# EAGLE design Pi1541_HAT (EAGLE 9.2.2)
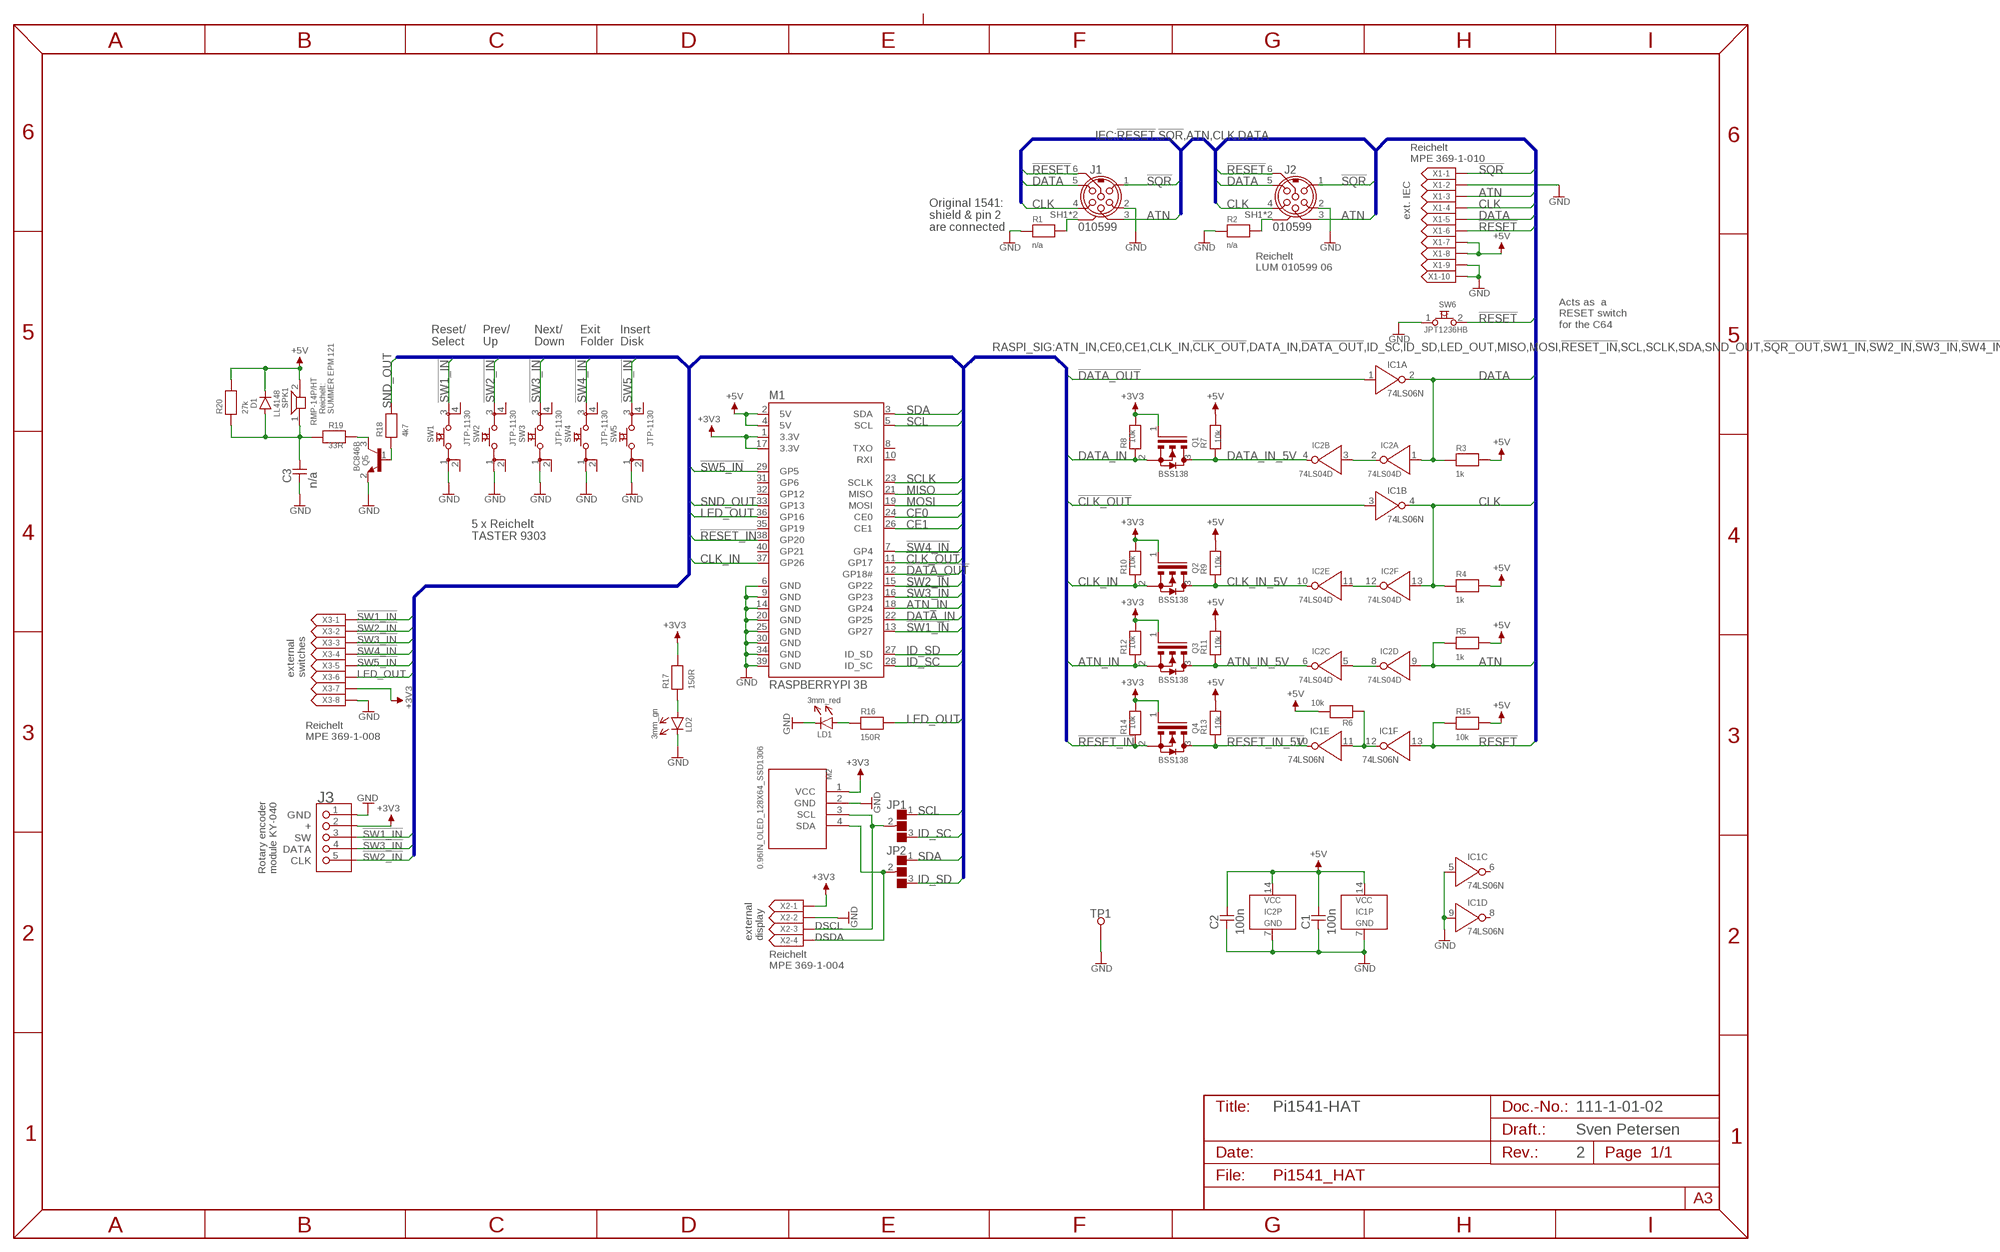
[diagram p0: schematic, sheet 1]

## Parts
C1  100n  C-0805  [0805]
C2  100n  C-0805  [0805]
C3  n/a  C-0805  [0805]
D1  LL4148  [SOD80C]
IC1  74LS06N  7406N  [DIL-14]
IC2  74LS04D  74HC04  [SO-14]
J1  010599  [010599]
J2  010599  [010599]
J3  PINHD-1X5  [1X05]
JP1  JMP_0603  [CP3P]
JP2  JMP_0603  [CP3P]
LD1  3mm_red  3MM  [3MM]
LD2  3mm_gn  3MM  [3MM]
M1  RASPBERRYPI 3B  RASPBERRYPI-40-PIN-GPIO  [PI_HAT_40P]
M2  0.96IN_OLED_128X64_SSD1306  [OLED_0.96_SSD1306]
Q1  BSS138  [SOT23]
Q2  BSS138  [SOT23]
Q3  BSS138  [SOT23]
Q4  BSS138  [SOT23]
Q5  BC846B  BC846  [SOT23]
R1  n/a  R-0805  [0805]
R2  n/a  R-0805  [0805]
R3  1k  R-0805  [0805]
R4  1k  R-0805  [0805]
R5  1k  R-0805  [0805]
R6  10k  R-0805  [0805]
R7  10k  R-0805  [0805]
R8  10k  R-0805  [0805]
R9  10k  R-0805  [0805]
R10  10k  R-0805  [0805]
R11  10k  R-0805  [0805]
R12  10k  R-0805  [0805]
R13  10k  R-0805  [0805]
R14  10k  R-0805  [0805]
R15  10k  R-0805  [0805]
R16  150R  R-0805  [0805]
R17  150R  R-0805  [0805]
R18  4k7  R-0805  [0805]
R19  33R  R-0805  [0805]
R20  27k  R-0805  [0805]
SPK1  RMP-14P/HT  [RMP-14P/HT]
SW1  JTP-1130  [JTP-1130]
SW2  JTP-1130  [JTP-1130]
SW3  JTP-1130  [JTP-1130]
SW4  JTP-1130  [JTP-1130]
SW5  JTP-1130  [JTP-1130]
SW6  JPT1236HB  [JTP_1236HB]
TP1  L1,2_R  [1,2MM_R]
X1  369-1-010  MICMA10B-THT  [MICMA10B]
X2  369-1-004  MICMA04B-THR  [MICMA04B]
X3  369-1-008  MICMA08B  [MICMA08B]

## Nets
!CLK_OUT: IC1.3(B:I) M1.11(GP17)
!DATA_OUT: IC1.1(A:I) M1.12(GP18#)
!RESET: IC1.13(F:I) J1.6 J2.6 R15.1 SW6.2 X1.6
!RESET_IN: M1.38(GP20) Q4.2(S) R14.1
!RESET_IN_5V: IC1.10(E:O) Q4.3(D) R13.1
!SQR: J1.1 J2.1 X1.1
!SW1_IN: J3.3 M1.13(GP27) SW1.3 X3.1
!SW2_IN: J3.5 M1.15(GP22) SW2.3 X3.2
!SW3_IN: J3.4 M1.16(GP23) SW3.3 X3.3
!SW4_IN: M1.7(GP4) SW4.3 X3.4
!SW5_IN: M1.29(GP5) SW5.3 X3.5
+3V3: J3.2 M1.1(3.3V) M1.17(3.3V) M2.1(VCC) Q1.1(G) Q2.1(G) Q3.1(G) Q4.1(G) R8.2 R10.2 R12.2 R14.2 R17.2 X2.1 X3.7
+5V: C1.2 C2.2 D1.K IC1.14(P:VCC) IC2.14(P:VCC) M1.2(5V) M1.4(5V) R3.2 R4.2 R5.2 R6.2 R7.2 R9.2 R11.2 R13.2 R15.2 R20.2 SPK1.2 X1.7 X1.8
ATN: IC2.9(D:I) J1.3 J2.3 R5.1 X1.3
ATN_IN: M1.18(GP24) Q3.2(S) R12.1
ATN_IN_5V: IC2.6(C:O) Q3.3(D) R11.1
CE0: M1.24(CE0)
CE1: M1.26(CE1)
CLK: IC1.4(B:O) IC2.13(F:I) J1.4 J2.4 R4.1 X1.4
CLK_IN: M1.37(GP26) Q2.2(S) R10.1
CLK_IN_5V: IC2.10(E:O) Q2.3(D) R9.1
DATA: IC1.2(A:O) IC2.1(A:I) J1.5 J2.5 R3.1 X1.5
DATA_IN: M1.22(GP25) Q1.2(S) R8.1
DATA_IN_5V: IC2.4(B:O) Q1.3(D) R7.1
DSCL: JP1.2 M2.3(SCL) X2.3
DSDA: JP2.2 M2.4(SDA) X2.4
GND: C1.1 C2.1 C3.1 IC1.5(C:I) IC1.7(P:GND) IC1.9(D:I) IC2.7(P:GND) J1.2 J2.2 J3.1 LD1.K LD2.K M1.6(GND) M1.9(GND) M1.14(GND) M1.20(GND) M1.25(GND) M1.30(GND) M1.34(GND) M1.39(GND) M2.2(GND) Q5.2(E) R1.1 R2.1 SW1.1 SW2.1 SW3.1 SW4.1 SW5.1 SW6.1 TP1.1 X1.2 X1.9 X1.10 X2.2 X3.8
ID_SC: JP1.3 M1.28(ID_SC)
ID_SD: JP2.3 M1.27(ID_SD)
LED_OUT: M1.36(GP16) R16.2 X3.6
MISO: M1.21(MISO)
MOSI: M1.19(MOSI)
N$1: J1.SH1(SH) J1.SH2(SH) R1.2
N$2: J2.SH1(SH) J2.SH2(SH) R2.2
N$3: IC2.2(A:O) IC2.3(B:I)
N$4: IC2.11(E:I) IC2.12(F:O)
N$5: IC2.5(C:I) IC2.8(D:O)
N$6: IC1.11(E:I) IC1.12(F:O) R6.1
N$7: LD2.A R17.1
N$8: Q5.1(B) R18.1
N$9: Q5.3(C) R19.2
N$10: C3.2 D1.A R19.1 R20.1 SPK1.1
N$12: LD1.A R16.1
SCL: JP1.1 M1.5(SCL)
SCLK: M1.23(SCLK)
SDA: JP2.1 M1.3(SDA)
SND_OUT: M1.33(GP13) R18.2
Unconnected: IC1.6(C:O) IC1.8(D:O) M1.8(TXO) M1.10(RXI) M1.31(GP6) M1.32(GP12) M1.35(GP19) M1.40(GP21) SW1.2 SW1.4 SW2.2 SW2.4 SW3.2 SW3.4 SW4.2 SW4.4 SW5.2 SW5.4

## Buses
IEC:!RESET,!SQR,ATN,CLK,DATA
RASPI_SIG:ATN_IN,CE0,CE1,CLK_IN,!CLK_OUT,DATA_IN,!DATA_OUT,ID_SC,ID_SD,LED_OUT,MISO,MOSI,!RESET_IN,SCL,SCLK,SDA,SND_OUT,!SQR_OUT,!SW1_IN,!SW2_IN,!SW3_IN,!SW4_IN,!SW5_IN

## Notes on the sheet
- Reichelt
  MPE 369-1-010
- ext. IEC
- Original 1541:
  shield & pin 2 
  are connected
- Reichelt
  LUM 010599 06
- Acts as  a
  RESET switch
  for the C64
- Reset/
  Select
- Prev/
  Up
- Next/
  Down
- Exit
  Folder
- Insert
  Disk
- Reichelt:
  SUMMER EPM 121
- 5 x Reichelt
  TASTER 9303
- external
  switches
- Reichelt
  MPE 369-1-008
- GND
- +
- Rotary encoder
  module KY-040
- SW
- DATA
- CLK
- external
  display
- Reichelt
  MPE 369-1-004
- Pi1541-HAT | 111-1-01-02
- Sven Petersen
- 2

## Library data of the parts
C1-C3 = SMD:C-0805
D1 = Dioden:LL4148
IC1 = 74XXsmd:7406
IC2 = 74XXsmd:74*04: Hex inverter
J1 J2 = Lumberg:010599
J3 = PINHEAD:PINHD-1X5
JP1 JP2 = Cutpad:JMP_0603
LD1 LD2 = LED:3MM
M1 = Raspberry_Pi:RASPBERRYPI-40-PIN-GPIO: 40 pin GPIO header with the footprint of a HAT
M2 = OLED_Display:0.96IN_OLED_128X64_SSD1306
Q1-Q4 = Transistoren:BSS138
Q5 = Transistoren:BC846
R1-R20 = SMD:R-0805
SPK1 = KM:RMP-14P/HT
SW1-SW5 = Namae_Electronics:JTP-1130
SW6 = Namae_Electronics:JPT1236HB
TP1 = Pads:L1,2_R
X1 = AMP:MICMA10B
X2 = AMP:MICMA04B
X3 = AMP:MICMA08B

## Board
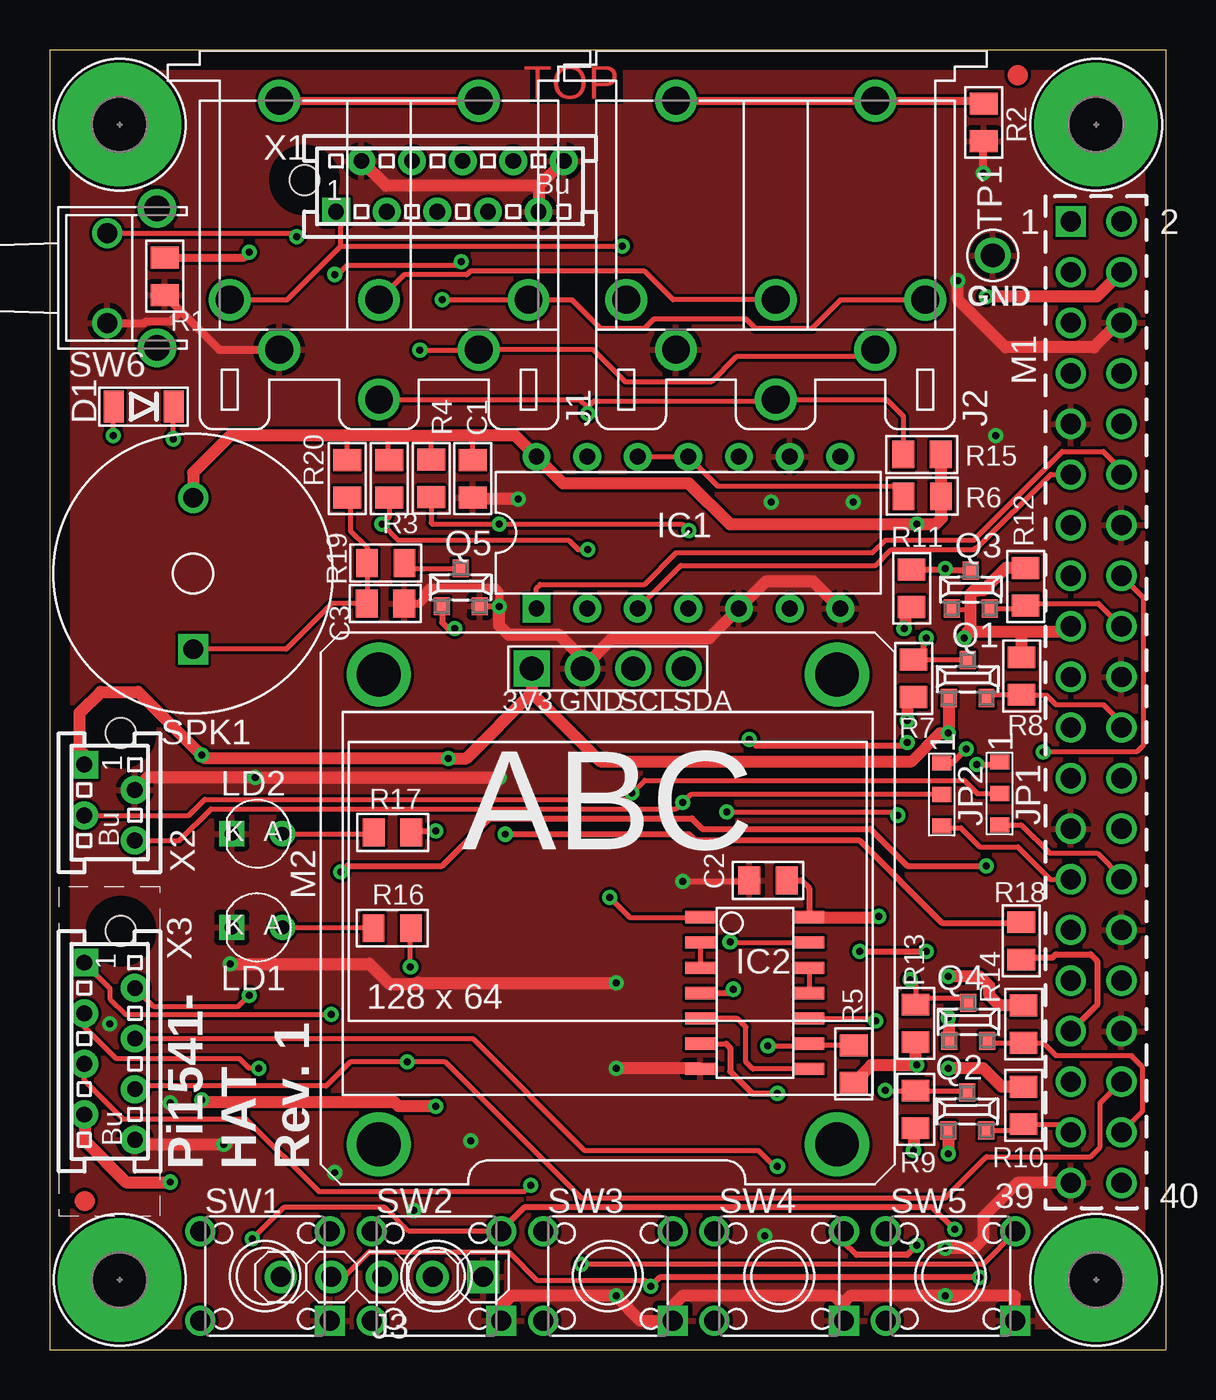
[diagram p1: board, top side]
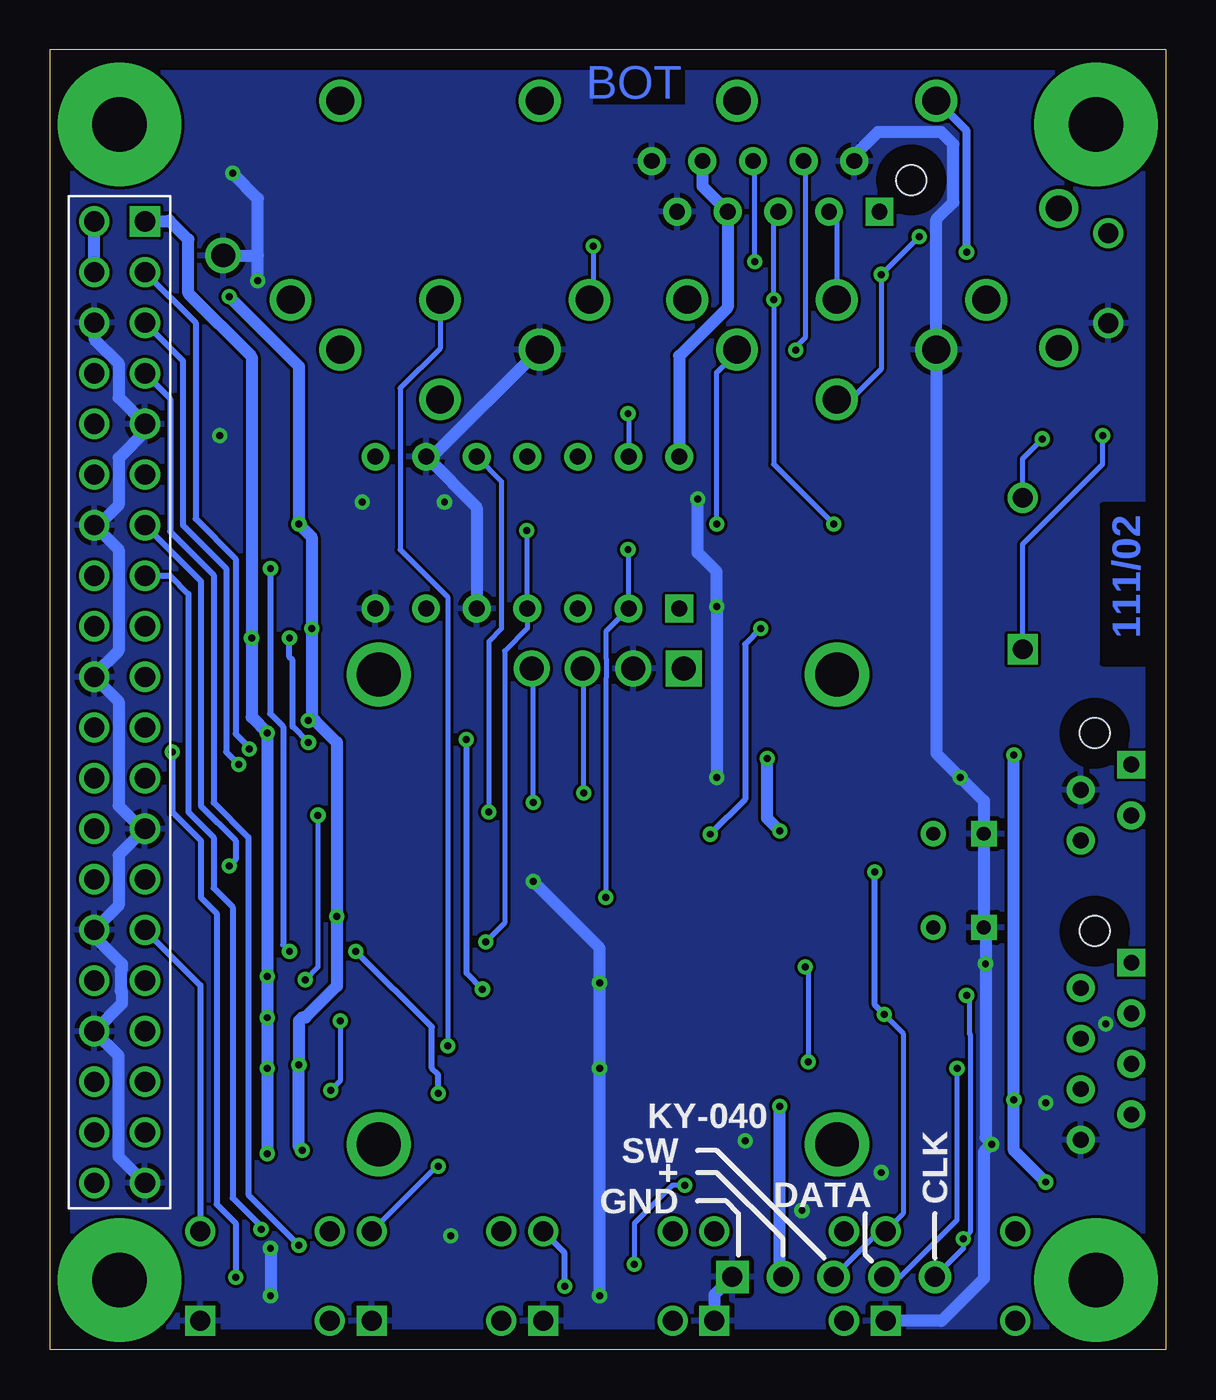
[diagram p2: board, bottom side, seen from below]

Size 56 x 65.25 mm. Coordinates in mm from the lower left corner, seen from the top.
Outline: 0,0 56,0 56,65.25 0,65.25 0,0
Copper layers (1*16): Top 0.035mm / dielectric 1.5mm / Bottom 0.035mm
Design rules "default *": minimum track width 6mil, minimum drill 0.35mm, track to track 6mil, track to pad 6mil, pad to pad 6mil, via to via 6mil, smd to smd 6mil, copper to edge 40mil, drill to drill 6mil, minimum pad ring 10mil, minimum via ring 8mil, stop-mask expansion 4mil, vias tented up to drill 0.5mm, thermal gap 10mil
bRestrict: 3 lines

### Footprints (pad centres in the part's own frame; a part is rotated, then mirrored left to right if it is on the bottom)
0805 = smd 1.092 x 1.397: 1 -0.94,0; 2 0.94,0
SOD80C = smd 1 x 1.6: A -1.5,0; K 1.5,0
DIL-14 = drill 0.8 pad 1.397 square: 1 -7.62,-3.81 | drill 0.8 pad 1.397: 2 -5.08,-3.81; 3 -2.54,-3.81; 4 0,-3.81; 5 2.54,-3.81; 6 5.08,-3.81; 7 7.62,-3.81; 8 7.62,3.81; 9 5.08,3.81; 10 2.54,3.81; 11 0,3.81; 12 -2.54,3.81; 13 -5.08,3.81; 14 -7.62,3.81
SO-14 = smd 0.61 x 1.524: 1 -3.81,-2.794; 2 -2.54,-2.794; 3 -1.27,-2.794; 4 0,-2.794; 5 1.27,-2.794; 6 2.54,-2.794; 7 3.81,-2.794; 8 3.81,2.667; 9 2.54,2.667; 10 1.27,2.667; 11 0,2.667; 12 -1.27,2.667; 13 -2.54,2.667; 14 -3.81,2.667
010599 = drill 1.4: 1 10,-7.5; 2 12.5,-5; 3 10,0; 4 12.5,5; 5 10,7.5; 6 15,0; SH1 0,5; SH2 0,-5
1X05 = drill 1 pad 1.626 square: 1 -5.08,0 | drill 1 pad 1.626: 2 -2.54,0; 3 0,0; 4 2.54,0; 5 5.08,0
CP3P = smd 0.762 x 0.965: 1 -1.575,0; 2 0,0; 3 1.575,0
3MM = drill 0.7 pad 1.27: A -1.27,0 | drill 0.7 pad 1.27 square: K 1.27,0
PI_HAT_40P = drill 1.016 square: 1 -1.27,24.13 | drill 1.016: 2 1.27,24.13; 3 -1.27,21.59; 4 1.27,21.59; 5 -1.27,19.05; 6 1.27,19.05; 7 -1.27,16.51; 8 1.27,16.51; 9 -1.27,13.97; 10 1.27,13.97; 11 -1.27,11.43; 12 1.27,11.43; 13 -1.27,8.89; 14 1.27,8.89; 15 -1.27,6.35; 16 1.27,6.35; 17 -1.27,3.81; 18 1.27,3.81; 19 -1.27,1.27; 20 1.27,1.27; 21 -1.27,-1.27; 22 1.27,-1.27; 23 -1.27,-3.81; 24 1.27,-3.81; 25 -1.27,-6.35; 26 1.27,-6.35; 27 -1.27,-8.89; 28 1.27,-8.89; 29 -1.27,-11.43; 30 1.27,-11.43; 31 -1.27,-13.97; 32 1.27,-13.97; 33 -1.27,-16.51; 34 1.27,-16.51; 35 -1.27,-19.05; 36 1.27,-19.05; 37 -1.27,-21.59; 38 1.27,-21.59; 39 -1.27,-24.13; 40 1.27,-24.13 | drill 2.75 pad 6.2: BHR1 0,-29; BHR2 0,29; BHR3 -49,29; BHR4 -49,-29
OLED_0.96_SSD1306 = drill 1.2 square: 1 -3.81,-1.8 | drill 1.2: 2 -1.27,-1.8; 3 1.27,-1.8; 4 3.81,-1.8 | drill 2.2 pad 3: MH1 -11.5,-2.1; MH2 11.5,-2.1; MH3 11.5,-25.7; MH4 -11.5,-25.7
SOT23 = smd 0.8 x 0.9: 1 -0.953,-0.953; 2 0.953,-0.953; 3 0,0.953
RMP-14P/HT = drill 1 square: 1 0,3.8 | drill 1: 2 0,-3.8
JTP-1130 = drill 1 square: 1 3.25,-2.25 | drill 1: 2 -3.25,-2.25; 3 3.25,2.25; 4 -3.25,2.25
JTP_1236HB = drill 1: 1 2.25,0; 2 -2.25,0 | drill 1.3: CS1 3.5,2.5; CS2 -3.5,2.5
1,2MM_R = drill 1.2: 1 0,0
MICMA10B = drill 0.787 pad 1.397 square: 1 5.715,1.27 | drill 0.787 pad 1.397: 2 4.445,-1.27; 3 3.175,1.27; 4 1.905,-1.27; 5 0.635,1.27; 6 -0.635,-1.27; 7 -1.905,1.27; 8 -3.175,-1.27; 9 -4.445,1.27; 10 -5.715,-1.27 | hole 1.499: 7.303,-0.318
MICMA04B = drill 0.8 pad 1.397 square: 1 1.905,1.27 | drill 0.8 pad 1.397: 2 0.635,-1.27; 3 -0.635,1.27; 4 -1.905,-1.27 | hole 1.5: 3.493,-0.568
MICMA08B = drill 0.787 pad 1.397 square: 1 4.445,1.27 | drill 0.787 pad 1.397: 2 3.175,-1.27; 3 1.905,1.27; 4 0.635,-1.27; 5 -0.635,1.27; 6 -1.905,-1.27; 7 -3.175,1.27; 8 -4.445,-1.27 | hole 1.5: 6.032,-0.568

### Placement (x,y rotation side)
C1  21.22,43.72 90 top
C2  36.04,23.56 0 top
C3  16.84,37.46 180 top
D1  4.71,47.34 0 top
IC1  32.04,41.01 0 top
IC2  35.44,17.9 270 top
J1  16.52,62.7 270 top
J2  36.42,62.7 270 top
J3  16.67,3.65 180 top
JP1  47.66,27.92 270 top
JP2  44.76,27.87 270 top
LD1  10.4,21.2 180 top
LD2  10.4,25.9 180 top
M1  52.5,32.5 0 top
M2  28,36 0 top
Q1  46.05,33.66 0 top
Q2  46.03,11.96 0 top
Q3  46.21,38.16 0 top
Q4  46.09,16.46 0 top
Q5  20.61,38.27 0 top
R1  5.76,53.88 90 top
R2  46.86,61.6 90 top
R3  17.04,43.72 90 top
R4  19.14,43.74 90 top
R5  40.34,14.34 270 top
R6  43.78,42.84 0 top
R7  43.34,33.7 270 top
R8  48.76,33.82 90 top
R9  43.44,12.06 270 top
R10  48.86,12.26 90 top
R11  43.24,38.22 270 top
R12  48.96,38.3 90 top
R13  43.44,16.38 270 top
R14  48.86,16.34 90 top
R15  43.76,44.94 0 top
R16  17.18,21.16 0 top
R17  17.2,25.96 0 top
R18  48.74,20.52 270 top
R19  16.86,39.48 0 top
R20  14.92,43.72 90 top
SPK1  7.19,38.96 180 top
SW1  10.8,3.7 0 top
SW2  19.4,3.7 0 top
SW3  28,3.7 0 top
SW4  36.6,3.7 0 top
SW5  45.2,3.7 0 top
SW6  2.88,53.79 270 top
TP1  47.31,54.93 0 top
U$44  [2LAYER]  28.57,64.45 180 top
U$45  [PCB-TITLE/]  0,75.08 0 top  (outside the outline)
U$47  [SMD_REF_R1MM]  1.75,7.46 0 top
U$48  [SMD_REF_R1MM]  48.58,63.98 0 top
X1  20.08,58.4 180 top
X2  3,27.46 90 top
X3  3,14.98 90 top

### Tracks (layer width: path | path; a pad name or v marks a point on that pad's centre or on a via)
!CLK_OUT
  Top 0.254: IC1.3 31.67,39.37 41.43,39.37 42.23,40.16 46.35,40.16 46.42,40.23 46.52,40.23 50.22,43.93 M1.11
!DATA_OUT
  Top 0.254: IC1.1 24.42,38.23 24.61,38.42 29.84,38.42 31.43,40.01 41.27,40.01 41.91,40.64 46.35,40.64 50.8,45.09 52.86,45.09 53.77,44.18 M1.12
!RESET  (via drill 0.35)
  Top 0.254: v12.38,55.88 12.22,56.04 5.9,56.04 4.86,56.04 SW6.2 | v14.29,53.98 14.45,53.98 14.92,54.45 20.48,54.45 v20.64,54.61 | J1.6 26.59,47.7 26.99,47.31 | 26.99,47.31 27.3,47.62 36.34,47.62 J2.6 41.99,47.7 42.82,46.87 R15.1 | 26.99,47.31 v26.99,46.99
  Bottom 0.254: v12.38,55.88 v14.29,53.98 14.29,49.21 15.8,47.7 J1.6 | v20.64,54.61 20.64,59.66 X1.6 | v26.99,46.99 26.96,46.96 IC1.13
!RESET_IN
  Top 0.254: M1.38 54.81,11.95 54.81,14.2 54.29,14.72 54.29,14.76 50.48,14.76 49.85,15.4 R14.1 47.15,15.4 Q4.2
!RESET_IN_5V  (via drill 0.35)
  Top 0.254: Q4.3 45.87,17.64 43.76,17.64 R13.1 43.44,18.31 v43.18,18.57 | v33.97,26.99 42.39,26.99 v42.55,26.83
  Bottom 0.254: IC1.10 33.34,43.58 33.34,36.2 33.97,35.56 v33.97,26.99 | v42.55,26.83 42.55,19.21 v43.18,18.57
!SQR  (via drill 0.35)
  Top 0.254: J1.1 11.9,52.7 14.61,55.4 | 14.61,55.4 14.61,56.36 14.63,56.86 X1.1 | 14.61,55.4 v28.73,55.4
  Bottom 0.254: v28.73,55.4 28.73,52.89 J2.1
!SW1_IN  (via drill 0.35)
  Top 0.254: X3.1 3.02,18.14 3.02,17.62 3.81,16.83 v14.13,16.83
  Top 0.305: v14.61,23.97 14.92,24.29 19.68,24.29 22.07,26.67 32.21,26.67 32.74,26.15 41.16,26.15 43.02,24.29 v46.99,24.29
  Bottom 0.254: v14.13,16.83 13.18,15.88 13.18,6.83 13.97,6.03 SW1.3 | SW1.3 | J3.3 14.37,5.95 SW1.3
  Bottom 0.305: M1.13 48.42,38.58 48.42,27.3 46.67,25.56 46.67,24.61 v46.99,24.29 | v14.13,16.83 14.61,17.3 v14.61,23.97
!SW2_IN  (via drill 0.35)
  Top 0.254: SW2.3 18.02,5.95 16.83,7.14 11.75,7.14 v10.16,5.56 | X3.2 5.19,17.23 9.46,17.23 v10,17.78
  Top 0.305: v45.4,6.03 44.29,7.14 23.81,7.14 22.65,5.98 SW2.3
  Bottom 0.254: v10,17.78 9.84,17.62 9.84,15.85 9.82,15.83 9.82,5.9 v10.16,5.56 10.16,5.08 J3.5
  Bottom 0.305: M1.15 49.96,38.85 49.05,37.94 49.05,26.99 47.78,25.72 47.78,23.18 46.83,22.23 46.83,7.62 45.4,6.19 v45.4,6.03
!SW3_IN  (via drill 0.35)
  Top 0.254: v10.48,14.13 10,14.13 9.53,14.61 3.33,14.61 1.73,16.21 X3.3 | M1.16 54.86,37.76 54.86,30.32 54.54,30 v49.85,30 | J3.4 14.76,3.65 16.03,4.92 23.02,4.92 24.44,3.49 29.84,3.49 v30.16,3.17
  Top 0.305: v30.16,3.17 30.62,3.63 v46.67,3.63
  Bottom 0.254: J3.4 13.34,3.65 10.48,6.51 v10.48,14.13
  Bottom 0.305: v49.85,30 49.85,26.99 48.42,25.56 48.42,22.7 47.62,21.91 47.62,7.3 46.67,6.35 v46.67,3.63 | v30.16,3.17 30.16,4.86 SW3.3
!SW4_IN  (via drill 0.35)
  Top 0.254: v36.51,9.21 36.51,9.05 35.56,10 26.83,10 21.21,15.62 X3.4
  Top 0.305: v43.5,5.24 43.02,4.76 40.48,4.76 39.85,5.39 SW4.3
  Bottom 0.254: v36.51,9.21 36.59,9.21 SW4.3
  Bottom 0.305: M1.7 49.96,47.74 49.96,41.07 47.78,38.89 47.78,27.46 46.04,25.72 46.04,7.78 v43.5,5.24
!SW5_IN  (via drill 0.35)
  Top 0.254: SW5.3 48.45,5.91 46.83,4.29 v26.67,4.29 | X3.5 1.73,13.51 3.65,11.59 9.84,11.59 13.49,7.94 23.81,7.94 v24.13,8.26
  Bottom 0.254: v24.13,8.26 24.77,8.26 26.67,6.35 v26.67,4.29
  Bottom 0.305: M1.29 48.45,18.29 SW5.3
+3V3  (via drill 0.35)
  Top 0.254: Q3.1 45.32,37.15 46.04,37.15 46.04,36.04
  Top 0.305: R17.2 18.21,26.04 v19.37,26.04
  Top 0.55: 43.24,29.53 44.67,30.96
  Top 0.61: M2.1 24.19,32.96 | 43.24,29.53 27.62,29.53 24.19,32.96 | 44.67,30.96 v45.09,30.96 v45.1,30.97 Q1.1 | M1.17 50.96,36.04 48.74,36.04 | 46.2,36.04 v45.88,35.72 | 48.74,36.04 46.2,36.04 | 46.2,36.04 46.04,36.04 | Q4.1 45.14,16.62 v45.09,16.67 | Q2.1 45.08,9.85 v45.09,9.84 | R10.2 47.76,13.2 46.83,14.13 v45.09,14.13 | R14.2 47.65,17.28 47.15,17.78 47.15,18.26 46.67,18.73 v45.09,18.73 | R8.2 48.76,36.01 48.74,36.04 | R12.2 47.97,39.24 46.85,38.12 46.57,38.12 46.56,38.1 46.35,38.1 46.2,37.94 46.2,36.04 | 24.19,32.96 20.92,29.69 v20,29.69 7.78,29.69 v7.62,29.84 7.6,29.84 4.42,33.02 2.54,33.02 1.5,31.98 1.5,30.09 1.73,29.86 X2.1 | X3.7 1.75,11.79 1.75,10.48 3.81,8.41 v6.03,8.41 | v7.62,12.54 7.74,12.42 17.3,12.42 17.5,12.22 v19.37,12.22
  Bottom 0.61: M1.1 50.05,56.63 50.01,56.67 49.05,55.72 49.05,53.02 45.88,49.85 v45.88,35.72 45.88,31.75 v45.09,30.96 v45.09,18.73 v45.09,16.67 v45.09,14.13 v45.09,9.84 | v19.37,26.04 20,26.67 v20,29.69 | v6.03,8.41 7.62,10 v7.62,12.54 v7.62,29.84 | J3.2 19.37,3.81 v19.37,12.22
+5V  (via drill 0.35)
  Top 0.254: v6.19,45.72 6.19,47.32 D1.K | R3.2 16.99,44.71 16.99,45.88 | R4.2 19.14,45.88 | C1.2 21.22,45.78 21.11,45.88 | R20.2 14.92,45.88
  Top 0.305: C2.2 37.72,23.56 38.11,23.17 IC2.14
  Top 0.61: SPK1.2 7.19,44.02 9.05,45.88 14.92,45.88 16.99,45.88 19.14,45.88 21.11,45.88 23.36,45.88 IC1.14 25.74,43.5 32.07,43.5 34.13,41.43 v43.5,41.43 44.45,41.43 44.77,41.75 44.72,41.8 R6.2 44.72,44.92 R15.2 | R7.2 43.02,32.44 v43.02,31.59 | R11.2 42.92,36.96 42.92,36.26 v42.86,36.2 | M1.4 52.54,52.86 v46.99,52.86 | R13.2 43.44,14.35 v43.5,14.29 41.24,14.29 41.23,14.28 41.22,14.28 R5.2 | R9.2 43.34,11.02 v43.34,10 | IC2.14 41.55,21.71 v41.59,21.75
  Bottom 0.254: SPK1.2 7.19,44.72 v6.19,45.72
  Bottom 0.61: M1.4 M1.2 | v46.99,52.86 43.5,49.37 v43.5,41.43 42.86,40.8 v42.86,36.2 42.86,31.75 v43.02,31.59 42.7,31.59 41.59,30.48 v41.59,21.75 41.59,18.26 43.18,16.67 43.34,16.67 43.5,16.51 v43.5,14.29 43.5,10.16 v43.34,10 | X1.8 23.25,58.4 X1.7 21.98,52.31 24.42,49.88 IC1.14
ATN  (via drill 0.35)
  Top 0.254: J2.3 31.28,52.7 29.84,54.13 21.09,54.13 20.91,53.95 17.77,53.95 J1.3 | v36.04,15.24 37.99,15.24 IC2.9 38.19,15.28 R5.1
  Bottom 0.254: J2.3 36.42,50.26 38.42,48.26 38.42,40.16 36.04,37.78 v36.04,15.24 | X1.3 16.52,56.74 J1.3
ATN_IN
  Top 0.254: M1.18 52.62,37.47 49.37,37.47 49.27,37.36 R12.1 48.81,37.21 Q3.2
ATN_IN_5V  (via drill 0.35)
  Top 0.254: IC2.6 33.93,15.36 | 43.08,39 R11.1 43.24,39.21 | 46.16,39.16 Q3.3
  Top 0.305: R11.1 44.88,39.16 v44.93,39.21 45.02,39.11 Q3.3 | 33.93,15.36 34.13,15.16 34.13,13.97 35.24,12.86 v36.51,12.86 | v40.64,20 v43.97,20
  Bottom 0.305: v36.51,12.86 36.51,13.81 36.83,14.13 36.83,16.19 v40.64,20 | v43.97,20 44.29,20.32 44.29,31.27 44.94,31.93 44.94,39.19 v44.93,39.21
CLK  (via drill 0.35)
  Top 0.254: v18.57,50.16 21.48,50.16 J1.4 27.27,50.2 28.89,48.58 33.18,48.58 34.45,49.85 41.07,49.85 J2.4 | R4.1 19.14,41.51 19.21,41.43 v22.54,41.43 31.75,41.43 v32.07,41.12 | v34.13,20.48 34.17,20.44 IC2.13
  Bottom 0.254: v32.07,41.12 32.07,37.23 IC1.4 32.04,36.22 33.18,35.08 33.18,21.43 v34.13,20.48 | v22.54,41.43 22.54,49.05 22.07,49.53 22.07,49.65 J1.4 | X1.4 18.1,59.59 18.1,50.8 18.57,50.32 v18.57,50.16
CLK_IN
  Top 0.254: M1.37 50.82,11.32 R10.1 48.55,11.01 Q2.2
CLK_IN_5V  (via drill 0.35)
  Top 0.254: Q2.3 45.94,13 R9.1 41.93,13 v41.91,13.02 | IC2.10 41,16.63 41.12,16.51 v41.43,16.51
  Bottom 0.254: v41.43,16.51 41.43,13.49 v41.91,13.02
DATA  (via drill 0.35)
  Top 0.254: v19.68,52.7 J1.5 26.2,52.7 27.62,51.28 29.84,51.28 30.32,51.75 34.92,51.75 35.4,51.28 38.26,51.28 39.69,52.7 J2.5 | R3.1 17.04,41.8 v16.67,41.43 17.46,40.64 26.04,40.64 26.51,40.16 v26.99,40.16 | v28.1,22.7 29.09,21.71 IC2.1
  Bottom 0.254: X1.5 19.68,56.79 v19.68,52.7 19.68,44.45 v16.67,41.43 | v26.99,40.16 26.99,37.23 IC1.2 28.1,36.06 28.1,34.7 28.09,34.69 28.09,33.71 28.1,33.7 v28.1,22.7
DATA_IN
  Top 0.254: M1.22 53.77,31.48 52.86,32.38 50.48,32.38 50.01,32.86 48.78,32.86 R8.1 48.74,32.86 47.16,32.86 Q1.2
DATA_IN_5V  (via drill 0.35)
  Top 0.254: R7.1 43.81,34.64 46.02,34.64 Q1.3
  Top 0.305: IC2.4 34.09,17.9 v34.29,18.1 | v35.11,30.64 35.42,30.32 42.86,30.32 v43.02,30.48 | v43.97,35.72 43.81,35.56 43.81,34.64
  Bottom 0.305: v34.29,18.1 35.08,18.89 35.08,30.62 v35.11,30.64 | v43.02,30.48 43.81,31.27 43.81,34.61 43.97,34.77 v43.97,35.72
DSCL  (via drill 0.35)
  Top 0.254: X2.3 6.98,26.82 7.78,27.62 28.89,27.62 v29.21,27.94 29.84,28.57 45.88,28.57 46.53,27.92 JP1.2
  Bottom 0.254: v29.21,27.94 29.21,34.14 M2.3
DSDA  (via drill 0.35)
  Top 0.254: X2.4 6.5,25.55 8.1,27.15 31.43,27.15 v31.75,27.46 32.16,27.87 JP2.2
  Bottom 0.254: v31.75,27.46 31.75,34.14 M2.4
GND  (via drill 0.35)
  Top 0.254: 21.55,37.31 Q5.2
  Top 0.305: v22.54,37.31 21.57,37.31 Q5.2 | v31.75,23.5 35.03,23.5 C2.1
  Top 0.406: R1.1 6.57,52.13 | 6.57,52.13 8.5,50.2 J1.2 | SW6.1 4.75,51.54 4.83,51.62 6.06,51.62 6.57,52.13 | v46.83,59.05 46.83,60.63 R2.1 | C3.1 18.57,37.46 18.89,37.78 18.89,38.1 19.05,38.26 22.38,38.26 22.54,38.1 v22.54,37.31
  Top 0.61: SW2.1 22.65,2.12 22.65,2.17 23.18,2.7 v28.42,2.7 29.69,1.43 31.11,1.43 SW3.1 31.25,2.04 31.27,2.06 31.27,2.22 31.75,2.7 39.37,2.7 39.85,2.22 | SW4.1 39.85,2.22 | SW5.1 48.42,1.48 48.42,2.7 v44.93,2.7 40.16,2.7 39.85,2.38 39.85,2.22 | X3.8 4.49,10.32 v8.73,10.32 8.89,10.32 | IC1.7 38.28,38.58 35.96,38.58 IC1.5 33.1,35.72 28.25,35.72 M2.2 26.73,34.71 25.56,35.88 23.02,35.88 22.54,36.35 v22.54,37.31 | v23.5,42.7 21.29,42.7 C1.1 | X2.2 4.91,28.73 v10.32,28.73 v22.54,28.73 | IC2.7 32.61,14.13 v28.42,14.13 | M1.39 48.53,8.37 46.83,6.67 46.83,5.56 46.35,5.08 v44.93,5.08 | M1.6 53.61,51.55 52.39,50.32 47.94,50.32 45.56,52.7 v45.56,53.66 | X1.10 24.55,58.42 | X1.2 16.88,58.42 24.55,58.42 | X1.9 24.55,57.15 24.55,58.42 | v9.05,19.37 16.03,19.37 17.03,18.37 18.44,18.37 18.48,18.41 v28.42,18.41
  Bottom 0.61: 11.52,34.2 J1.2 11.52,56.74 10.66,57.6 10.66,60.51 11.27,61.12 14.45,61.12 15.63,59.93 X1.2 | 11.52,34.06 11.52,29.93 v10.32,28.73 9.13,27.55 LD2.K LD1.K 9.05,21.11 v9.05,19.37 9.05,10.64 v8.73,10.32 9.13,9.92 9.13,3.57 11.27,1.43 11.29,1.45 SW1.1 | J2.2 36.8,44.82 IC1.9 34.58,42.28 IC1.5 | v23.5,42.7 23.5,40.01 22.54,39.05 v22.54,37.31 v22.54,28.73 | v28.42,2.7 v28.42,14.13 v28.42,18.41 28.42,20.16 v31.75,23.5 | M1.6 53.77,50.73 52.55,49.52 52.55,47.79 M1.9 51.23,46.08 52.55,44.77 52.55,42.39 53.82,41.12 53.82,41.34 M1.14 52.55,40.17 52.55,35.08 53.77,33.86 M1.20 52.55,32.55 52.55,27.3 51.39,26.15 M1.25 52.55,24.83 52.55,22.29 M1.30 53.77,20.75 52.39,19.37 52.39,19.1 52.45,19.04 52.45,18.02 52.39,17.96 52.39,17.37 M1.34 52.55,14.76 52.55,9.68 52.54,9.68 M1.39 | v44.93,5.08 v44.93,2.7 | v45.56,53.66 45.56,54.93 | 45.56,54.93 45.56,57.78 v46.83,59.05 | TP1.1 45.56,54.93 | J3.1 22.65,2.75 SW2.1
  other vias: 47.47,45.88 36.2,42.55 40.32,42.55 35.88,5.71 21.11,10.48 14.29,8.89 18.26,6.99 6.03,12.38 3.02,16.35
  pour Top: 0.48,64.77 0.48,0.48 55.56,0.48 55.56,64.77
  pour Bottom: 0.48,64.77 55.56,64.77 55.56,0.48 0.48,0.48
ID_SC
  Top 0.254: JP1.3 48.74,26.34 50.16,24.92 52.55,24.92 53.77,23.7 M1.28
ID_SD
  Top 0.254: JP2.3 44.86,26.19 45.72,26.19 46.67,25.24 48.58,25.24 50.21,23.61 M1.27
LED_OUT  (via drill 0.35)
  Top 0.254: X3.6 4.43,13.23 13.87,13.23 15.08,14.45 v17.94,14.45 19.84,14.45 26.67,7.62 44.93,7.62 46.99,9.68 52.23,9.68 52.7,10.16 52.7,12.38 M1.36 | v18.1,19.21 18.1,21.14 R16.2
  Bottom 0.254: v18.1,19.21 17.94,19.05 v17.94,14.45
N$1  (via drill 0.35)
  Top 0.406: R1.2 9.73,54.82 v10,55.09 | J1.SH2 J1.SH1
  Bottom 0.406: J1.SH2 10,61.18 v10,55.09
N$2
  Top 0.406: J2.SH2 J2.SH1 46.7,62.7 R2.2
N$3
  Top 0.254: IC2.2 IC2.3
N$4
  Top 0.254: IC2.12 IC2.11
N$5
  Top 0.254: IC2.8 35.28,14.09 34.92,14.45 34.92,16.19 34.49,16.63 IC2.5
N$6
  Top 0.254: IC1.12 IC1.11 33.52,43.34 42.34,43.34 R6.1
N$7
  Top 0.254: LD2.A 16.2,25.9 R17.1
N$8  (via drill 0.35)
  Top 0.305: Q5.1 19.68,37.29 19.68,36.51 20,36.2 v20.32,36.2 | v22.86,25.88 32.07,25.88 32.38,25.56 40.64,25.56 44.77,21.43 48.71,21.43 R18.1
  Bottom 0.305: v20.32,36.2 21.11,35.4 21.11,27.62 v22.86,25.88
N$9
  Top 0.254: R19.2 18.06,39.22 Q5.3
N$10  (via drill 0.35)
  Top 0.254: SPK1.1 11.85,35.16 14.15,37.46 C3.2 15.92,37.48 15.92,39.21 R19.1 15.92,40.28 15.08,41.12 15.08,42.62 R20.1 | v3.17,45.88 3.17,47.3 D1.A
  Bottom 0.254: SPK1.1 7.19,40.44 3.17,44.45 v3.17,45.88
N$12
  Top 0.254: LD1.A 16.2,21.2 R16.1
SCL  (via drill 0.35)
  Top 0.305: v46.51,29.37 47.53,29.37 JP1.1
  Bottom 0.305: M1.5 49.33,49.65 49.33,41.39 47.15,39.21 47.15,30 v46.51,29.37
SDA  (via drill 0.35)
  Top 0.305: v45.99,30.16 45.27,29.45 JP2.1
  Bottom 0.305: M1.3 48.69,51.55 48.69,41.71 46.67,39.69 46.67,30.91 45.99,30.23 v45.99,30.16
SND_OUT
  Top 0.305: R18.2 48.84,19.68 50.32,19.68 50.48,19.84 52.23,19.84 52.55,19.53 52.55,17.31 M1.33

### Text on the board
Bottom: 111/02
tPlace: GND | 3V3 | GND | SCL | SDA | Pi1541- / HAT / Rev. 1
bPlace: KY-040 | SW | + | DATA | CLK | GND
Document: 111-2-01-02 | Sven Petersen / 2019 | 35µm | 2 | 2
tDocu: CLK | DATA | SW | + | GND | KY-040 / Rotary / Encoder